# Altium schematic sheet PS_MIO.SchDoc
size A3
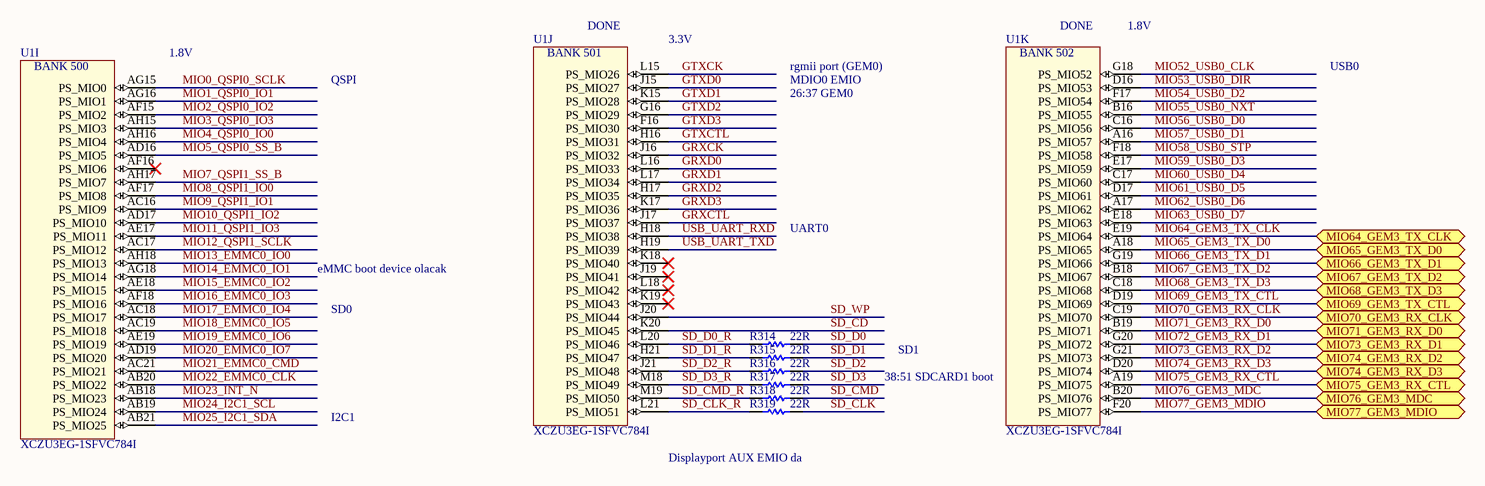
[diagram p0: PS_MIO.SchDoc]

## Parts
R314  value 22R  [RESC1005L_0402]  (hidden comment: RES0402_22R_0W1_1T)
R315  value 22R  [RESC1005L_0402]  (hidden comment: RES0402_22R_0W1_1T)
R316  value 22R  [RESC1005L_0402]  (hidden comment: RES0402_22R_0W1_1T)
R317  value 22R  [RESC1005L_0402]  (hidden comment: RES0402_22R_0W1_1T)
R318  value 22R  [RESC1005L_0402]  (hidden comment: RES0402_22R_0W1_1T)
R319  value 22R  [RESC1005L_0402]  (hidden comment: RES0402_22R_0W1_1T)
U1  XCZU3EG-1SFVC784I  [BGA784x28]  (parts I,J,K of 22)

## Ports
MIO64_GEM3_TX_CLK, MIO65_GEM3_TX_D0, MIO66_GEM3_TX_D1, MIO67_GEM3_TX_D2, MIO68_GEM3_TX_D3, MIO69_GEM3_TX_CTL, MIO70_GEM3_RX_CLK, MIO71_GEM3_RX_D0, MIO73_GEM3_RX_D1, MIO74_GEM3_RX_D2, MIO74_GEM3_RX_D3, MIO75_GEM3_RX_CTL, MIO76_GEM3_MDC, MIO77_GEM3_MDIO

## Nets
GRXCK: U1.J16(PS_MIO32)
GRXCTL: U1.J17(PS_MIO37)
GRXD0: U1.L16(PS_MIO33)
GRXD1: U1.L17(PS_MIO34)
GRXD2: U1.H17(PS_MIO35)
GRXD3: U1.K17(PS_MIO36)
GTXCK: U1.L15(PS_MIO26)
GTXCTL: U1.H16(PS_MIO31)
GTXD0: U1.J15(PS_MIO27)
GTXD1: U1.K15(PS_MIO28)
GTXD2: U1.G16(PS_MIO29)
GTXD3: U1.F16(PS_MIO30)
MIO0_QSPI0_SCLK: U1.AG15(PS_MIO0)
MIO1_QSPI0_IO1: U1.AG16(PS_MIO1)
MIO2_QSPI0_IO2: U1.AF15(PS_MIO2)
MIO3_QSPI0_IO3: U1.AH15(PS_MIO3)
MIO4_QSPI0_IO0: U1.AH16(PS_MIO4)
MIO5_QSPI0_SS_B: U1.AD16(PS_MIO5)
MIO7_QSPI1_SS_B: U1.AH17(PS_MIO7)
MIO8_QSPI1_IO0: U1.AF17(PS_MIO8)
MIO9_QSPI1_IO1: U1.AC16(PS_MIO9)
MIO10_QSPI1_IO2: U1.AD17(PS_MIO10)
MIO11_QSPI1_IO3: U1.AE17(PS_MIO11)
MIO12_QSPI1_SCLK: U1.AC17(PS_MIO12)
MIO13_EMMC0_IO0: U1.AH18(PS_MIO13)
MIO14_EMMC0_IO1: U1.AG18(PS_MIO14)
MIO15_EMMC0_IO2: U1.AE18(PS_MIO15)
MIO16_EMMC0_IO3: U1.AF18(PS_MIO16)
MIO17_EMMC0_IO4: U1.AC18(PS_MIO17)
MIO18_EMMC0_IO5: U1.AC19(PS_MIO18)
MIO19_EMMC0_IO6: U1.AE19(PS_MIO19)
MIO20_EMMC0_IO7: U1.AD19(PS_MIO20)
MIO21_EMMC0_CMD: U1.AC21(PS_MIO21)
MIO22_EMMC0_CLK: U1.AB20(PS_MIO22)
MIO23_INT_N: U1.AB18(PS_MIO23)
MIO24_I2C1_SCL: U1.AB19(PS_MIO24)
MIO25_I2C1_SDA: U1.AB21(PS_MIO25)
MIO52_USB0_CLK: U1.G18(PS_MIO52)
MIO53_USB0_DIR: U1.D16(PS_MIO53)
MIO54_USB0_D2: U1.F17(PS_MIO54)
MIO55_USB0_NXT: U1.B16(PS_MIO55)
MIO56_USB0_D0: U1.C16(PS_MIO56)
MIO57_USB0_D1: U1.A16(PS_MIO57)
MIO58_USB0_STP: U1.F18(PS_MIO58)
MIO59_USB0_D3: U1.E17(PS_MIO59)
MIO60_USB0_D4: U1.C17(PS_MIO60)
MIO61_USB0_D5: U1.D17(PS_MIO61)
MIO62_USB0_D6: U1.A17(PS_MIO62)
MIO63_USB0_D7: U1.E18(PS_MIO63)
MIO64_GEM3_TX_CLK: U1.E19(PS_MIO64) ; port MIO64_GEM3_TX_CLK
MIO65_GEM3_TX_D0: U1.A18(PS_MIO65) ; port MIO65_GEM3_TX_D0
MIO66_GEM3_TX_D1: U1.G19(PS_MIO66) ; port MIO66_GEM3_TX_D1
MIO67_GEM3_TX_D2: U1.B18(PS_MIO67) ; port MIO67_GEM3_TX_D2
MIO68_GEM3_TX_D3: U1.C18(PS_MIO68) ; port MIO68_GEM3_TX_D3
MIO69_GEM3_TX_CTL: U1.D19(PS_MIO69) ; port MIO69_GEM3_TX_CTL
MIO70_GEM3_RX_CLK: U1.C19(PS_MIO70) ; port MIO70_GEM3_RX_CLK
MIO71_GEM3_RX_D0: U1.B19(PS_MIO71) ; port MIO71_GEM3_RX_D0
MIO72_GEM3_RX_D1: U1.G20(PS_MIO72) ; port MIO73_GEM3_RX_D1
MIO73_GEM3_RX_D2: U1.G21(PS_MIO73) ; port MIO74_GEM3_RX_D2
MIO74_GEM3_RX_D3: U1.D20(PS_MIO74) ; port MIO74_GEM3_RX_D3
MIO75_GEM3_RX_CTL: U1.A19(PS_MIO75) ; port MIO75_GEM3_RX_CTL
MIO76_GEM3_MDC: U1.B20(PS_MIO76) ; port MIO76_GEM3_MDC
MIO77_GEM3_MDIO: U1.F20(PS_MIO77) ; port MIO77_GEM3_MDIO
SD_CD: U1.K20(PS_MIO45)
SD_CLK: R319.2
SD_CLK_R: R319.1 U1.L21(PS_MIO51)
SD_CMD: R318.2
SD_CMD_R: R318.1 U1.M19(PS_MIO50)
SD_D0: R314.2
SD_D0_R: R314.1 U1.L20(PS_MIO46)
SD_D1: R315.2
SD_D1_R: R315.1 U1.H21(PS_MIO47)
SD_D2: R316.2
SD_D2_R: R316.1 U1.J21(PS_MIO48)
SD_D3: R317.2
SD_D3_R: R317.1 U1.M18(PS_MIO49)
SD_WP: U1.J20(PS_MIO44)
USB_UART_RXD: U1.H18(PS_MIO38)
USB_UART_TXD: U1.H19(PS_MIO39)

Not connected (* = marked no-connect by the designer): U1 AF16(PS_MIO6)* J19(PS_MIO41)* K18(PS_MIO40)* K19(PS_MIO43)* L18(PS_MIO42)*

## Notes on the sheet
- 1.8V
- (near U1) DONE
- (near U1) 3.3V
- (near U1) 1.8V
- QSPI
- rgmii port (GEM0)
- 26:37 GEM0
- MDIO0 EMIO
- USB0
- UART0
- eMMC boot device olacak
- SD0
- 38:51 SDCARD1 boot
- SD1
- I2C1
- Displayport AUX EMIO da
- (in symbol XCZU3EG-1SFVC784I, part I) BANK 500
- (in symbol XCZU3EG-1SFVC784I, part J) BANK 501
- (in symbol XCZU3EG-1SFVC784I, part K) BANK 502

## Library data of the parts
R314-R319 = RES0402_22R_0W1_1T: RES SMD 22 OHM 1% 1/10W 0402; Manufacturer 1: Panasonic Electronic Components; Manufacturer Part Number 1: ERJ-2RKF22R0X; Package: 0402; ComponentLink1Description: Datasheet; Power: 1/10W; Tolerance: 1%; Supplier 1: Digi-Key; Supplier Part Number 1: P22.0LCT-ND
U1 = XCZU3EG-1SFVC784I: IC FPGA 252 I/O 784FCBGA - XILINX ZYNQ ULTRASCALE+; Manufacturer 1: Xilinx Inc.; Package: SFVC784; ComponentLink1Description: Datasheet; Supplier 1: Digi-Key; Supplier Part Number 1: XCZU3EG-1SFVC784I-ND; Manufacturer Part Number 1: XCZU3EG-1SFVC784I